# EAGLE design FakeFireATTINY13A (EAGLE 5.06)
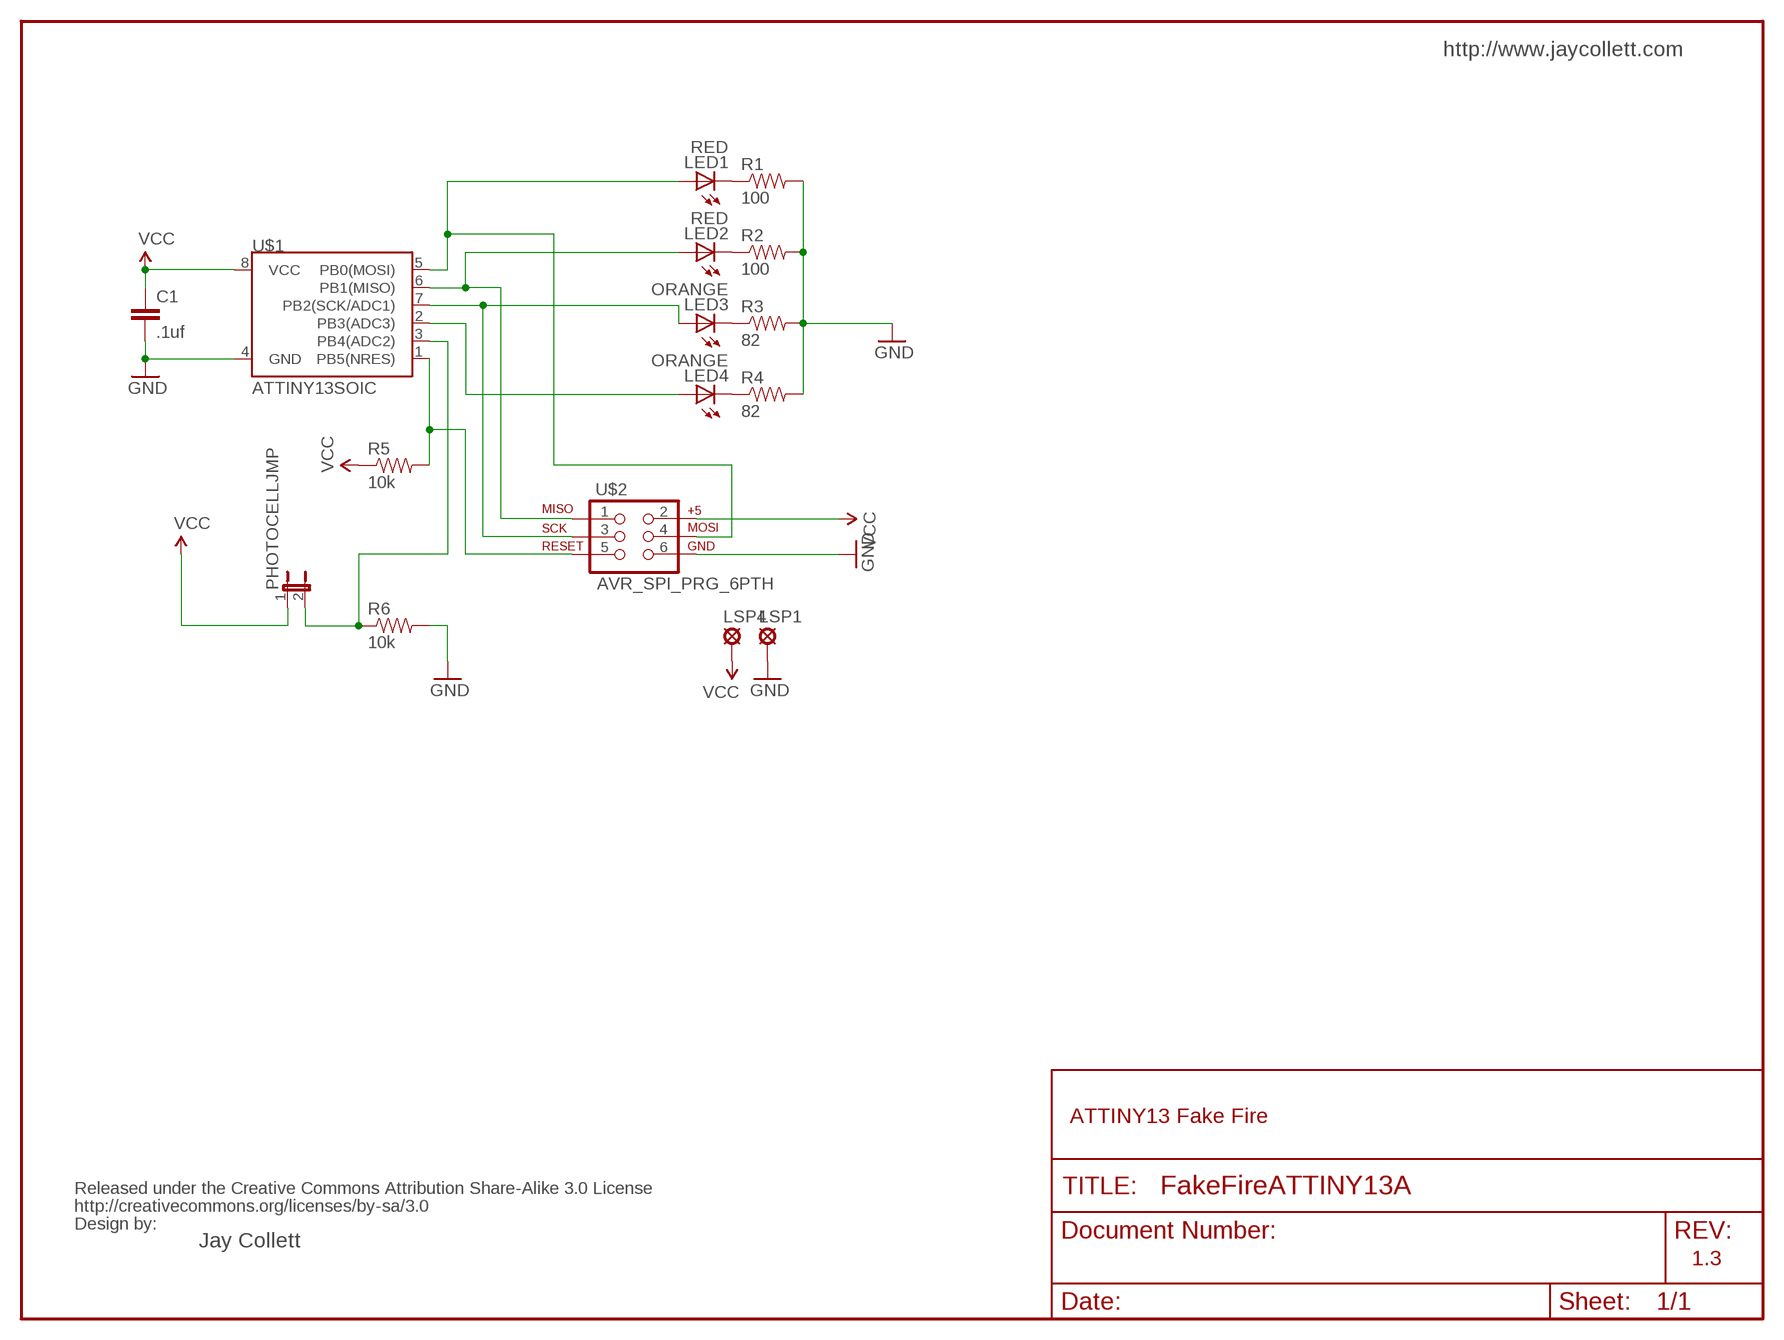
[diagram p0: schematic, sheet 1]

## Parts
C1  .1uf  CAP0603-CAP  [0603-CAP]
LED1  RED  LED3MM  [LED3MM]
LED2  RED  LED3MM  [LED3MM]
LED3  ORANGE  LED3MM  [LED3MM]
LED4  ORANGE  LED3MM  [LED3MM]
LSP1  LSP10  [LSP10]
LSP4  LSP10  [LSP10]
PHOTOCELLJMP  JUMPER-2PTH_LOCK  [1X02_LOCK]
R1  100  RESISTOR  [0805]
R2  100  RESISTOR  [0805]
R3  82  RESISTOR  [0805]
R4  82  RESISTOR  [0805]
R5  10k  RESISTOR  [0805]
R6  10k  RESISTOR  [0805]
U$1  ATTINY13SOIC  [SO08]
U$2  AVR_SPI_PRG_6PTH  [2X3]
U$3  CREATIVE_COMMONS  [CREATIVE_COMMONS]

## Nets
GND: C1.2 LSP1.MP R1.2 R2.2 R3.2 R4.2 R6.2 U$1.4(GND) U$2.6
N$1: LED3.A U$1.7(PB2(SCK/ADC1)) U$2.3
N$2: LED4.A U$1.2(PB3(ADC3))
N$3: LED1.K(C) R1.1
N$4: LED2.K(C) R2.1
N$5: LED3.K(C) R3.1
N$6: LED4.K(C) R4.1
N$8: R5.2 U$1.1(PB5(NRES)) U$2.5
N$9: LED1.A U$1.5(PB0(MOSI)) U$2.4
N$10: LED2.A U$1.6(PB1(MISO)) U$2.1
N$11: PHOTOCELLJMP.2 R6.1 U$1.3(PB4(ADC2))
VCC: C1.1 LSP4.MP PHOTOCELLJMP.1 R5.1 U$1.8(VCC) U$2.2

## Notes on the sheet
- http://www.jaycollett.com
- ATTINY13 Fake Fire
- Jay Collett
- 1.3

## Library data of the parts
C1 = SparkFun:CAP: Capacitor Standard 0603 ceramic capacitor, and 0.1" leaded capacitor.
LED1-LED4 = SparkFun:LED: LEDs Standard schematic elements and footprints for 5mm, 3mm, 1206, and 0603 sized LEDs. 5mm - Spark Fun Electronics SKU : COM-00529 (and others)
LSP1 LSP4 = solpad:LSP10: SOLDER PAD drill 1.0 mm, distributor Buerklin, 12H555
PHOTOCELLJMP = SparkFun:JUMPER-2: Jumper Basic 0.1" spaced jumper. Use with breakaway headers.
R1-R6 = SparkFun:RESISTOR: Resistor Basic schematic elements and footprints for 0603, 1206, and PTH 1/10th watt (small) resistors.
U$1 = SparkFun:ATTINY13
U$2 = SparkFun:AVR_SPI_PRG_6: AVR ISP 6 Pin This is the reduced ISP connector for AVR programming. Common on Arduino. This footprint will take up less PCB space and can be used with a 10-pin to 6-pin adapter such as SKU: BOB-08508
U$3 = SparkFun:CREATIVE_COMMONS

## Board
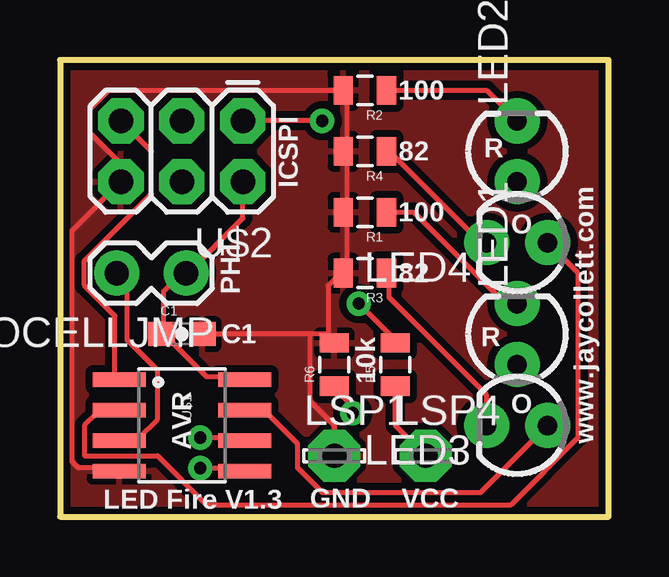
[diagram p1: board, top side]
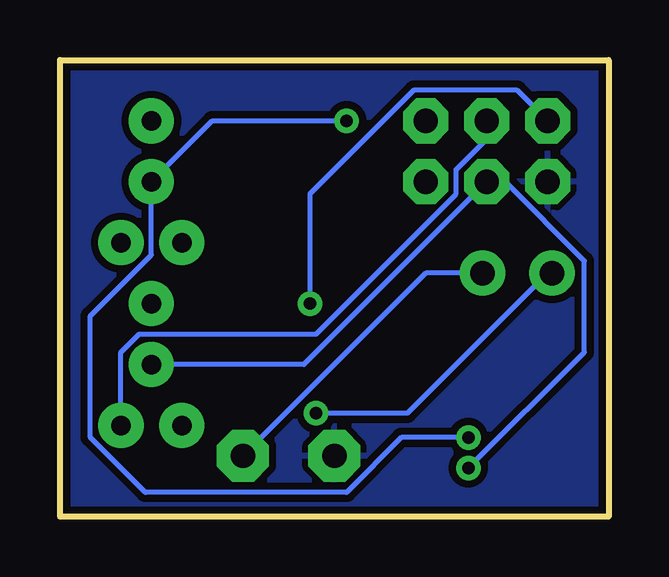
[diagram p2: board, bottom side, seen from below]

Size 22.86 x 19.05 mm. Coordinates in mm from the lower left corner, seen from the top.
Outline: 0,0 22.86,0 22.86,19.05 0,19.05 0,0
Copper layers (1*16): Top 0.035mm / dielectric 1.5mm / Bottom 0.035mm
Design rules "SparkFun": minimum track width 8mil, minimum drill 20mil, track to track 8mil, track to pad 8mil, pad to pad 8mil, via to via 8mil, smd to smd 8mil, copper to edge 10mil, drill to drill 8mil, minimum pad ring 12mil, minimum via ring 10mil, stop-mask expansion 4mil, vias tented up to drill 25mil, thermal gap 10mil

### Footprints (pad centres in the part's own frame; a part is rotated, then mirrored left to right if it is on the bottom)
0603-CAP = smd 1.1 x 1: 1 -0.85,0; 2 0.85,0
LED3MM = drill 0.813 pad 1.88 round: A -1.27,0; K 1.27,0
LSP10 = drill 1.016 pad 2.159 octagon: MP 0,0
1X02_LOCK = drill 1.016 pad 1.88 round: 1 -0.178,0; 2 2.718,0
0805 = smd 0.8 x 1.2: 1 -0.9,0; 2 0.9,0
SO08 = smd 0.61 x 2.21: 1 -1.905,-2.616; 2 -0.635,-2.616; 3 0.635,-2.616; 4 1.905,-2.616; 5 1.905,2.616; 6 0.635,2.616; 7 -0.635,2.616; 8 -1.905,2.616
2X3 = drill 1.016 pad 1.88 octagon: 1 0,0; 2 0,2.54; 3 2.54,0; 4 2.54,2.54; 5 5.08,0; 6 5.08,2.54

### Placement (x,y rotation side)
C1  5.08,7.62 0 top
LED1  19.05,7.62 90 top
LED2  19.05,15.24 90 top
LED3  19.05,3.81 180 top
LED4  19.05,11.43 180 top
LSP1  11.43,2.54 0 top
LSP4  15.24,2.54 0 top
PHOTOCELLJMP  5.08,10.16 180 top
R1  12.7,12.7 180 top
R2  12.7,17.78 180 top
R3  12.7,10.16 180 top
R4  12.7,15.24 180 top
R5  13.97,6.35 90 top
R6  11.43,6.35 90 top
U$1  5.08,3.81 270 top
U$2  7.62,16.51 180 top
U$3  1.27,7.62 0 top

### Tracks (layer width: path | path; a pad name or v marks a point on that pad's centre or on a via)
GND
  Top 0.203: U$1.4 2.29,2.03 0.76,2.03 0.51,2.29 0.51,11.94 U$2.6 2.54,14.73 1.27,16 1.27,17.02 2.03,17.78 R2.2 11.94,17.78 11.94,15.24 | 11.18,7.62 10.41,7.62 | 11.18,7.62 11.43,7.37 R6.2 11.18,7.62 | 10.41,7.62 C1.2 | 11.94,12.7 11.94,10.16 R3.2 11.68,10.16 11.18,9.65 11.18,7.62 | 11.94,15.24 11.94,12.7 | 11.94,12.7 R1.2 | 11.94,15.24 R4.2 | LSP1.MP 11.43,3.81 10.41,4.83 10.41,7.62
  pour Bottom (isolate 0.305): 0,19.05 0,0 22.86,0 22.86,19.05
  pour Top (isolate 0.305): 0,19.05 0,0 22.86,0 22.86,19.05
N$1
  Top 0.203: LED3.A 17.53,1.02 10.92,1.02 9.91,2.03 9.91,3.05 8.64,4.32 7.87,4.32 U$1.7
  Bottom 0.203: U$2.3 5.08,15.75 6.35,14.48 6.35,13.46 12.19,7.62 19.56,7.62 20.32,6.86 LED3.A
N$2
  Top 0.203: LED4.A 21.59,10.16 21.59,3.3 18.8,0.51 6.1,0.51 4.06,2.54 1.02,2.54 1.02,3.81 1.52,4.32 2.29,4.32 U$1.2
N$3
  Top 0.203: LED1.K 18.54,8.89 14.73,12.7 R1.1
N$4
  Top 0.203: LED2.K 17.78,17.78 R2.1
N$5
  Top 0.203: LED3.K 17.78,5.08 13.72,9.14 13.72,10.16 R3.1
N$6
  Top 0.203: LED4.K 17.53,11.43 13.72,15.24 R4.1
N$8  (via drill 0.51)
  Top 0.203: v12.45,8.89 13.97,7.37 R5.2 | U$2.5 3.81,15.24 3.81,13.46 1.02,10.67 1.02,9.65 2.29,8.38 2.29,5.84 U$1.1
  Bottom 0.203: v12.45,8.89 12.45,13.46 8.13,17.78 3.81,17.78 U$2.5
N$9  (via drill 0.51)
  Top 0.203: v5.84,2.03 7.62,2.03 U$1.5
  Bottom 0.203: v5.84,2.03 1.02,6.86 1.02,10.67 4.32,13.97 U$2.4 12.7,6.35 LED1.A
N$10  (via drill 0.51)
  Top 0.203: v5.84,3.3 7.62,3.3 U$1.6 | v10.92,16.51 U$2.1
  Bottom 0.203: v5.84,3.3 8.64,3.3 10.92,1.02 19.3,1.02 21.59,3.3 21.59,8.38 19.05,10.92 LED2.A 16.51,16.51 v10.92,16.51
N$11  (via drill 0.51)
  Top 0.203: v12.19,4.32 12.19,4.57 11.43,5.33 R6.1 | U$1.3 2.54,3.3 3.3,3.3 4.06,4.06 4.06,6.1 2.79,7.37 2.79,9.91 2.54,10.16 PHOTOCELLJMP.2
  Bottom 0.203: v12.19,4.32 8.38,4.32 2.54,10.16 PHOTOCELLJMP.2
VCC
  Top 0.203: LSP4.MP 13.97,3.81 R5.1 | 4.32,7.62 4.32,9.4 5.08,10.16 PHOTOCELLJMP.1 5.33,10.16 7.62,12.45 U$2.2 | 4.32,7.62 6.1,5.84 7.62,5.84 U$1.8 | C1.1 4.32,7.62
  Bottom 0.203: LSP4.MP 7.62,10.16 PHOTOCELLJMP.1

### Text on the board
tPlace: 100 | 82 | R | ICSPI | 100 | O | 82 | PHT | C1 | 10k | R | O | AVR | www.jaycollett.com | LED Fire V1.3 | GND | VCC